# Altium schematic sheet EPS_CTRL_AB_Supply.SchDoc: CTRL-A and CTRL-B / Supply
size A4; SheetNumber: 16; SheetTotal: 51
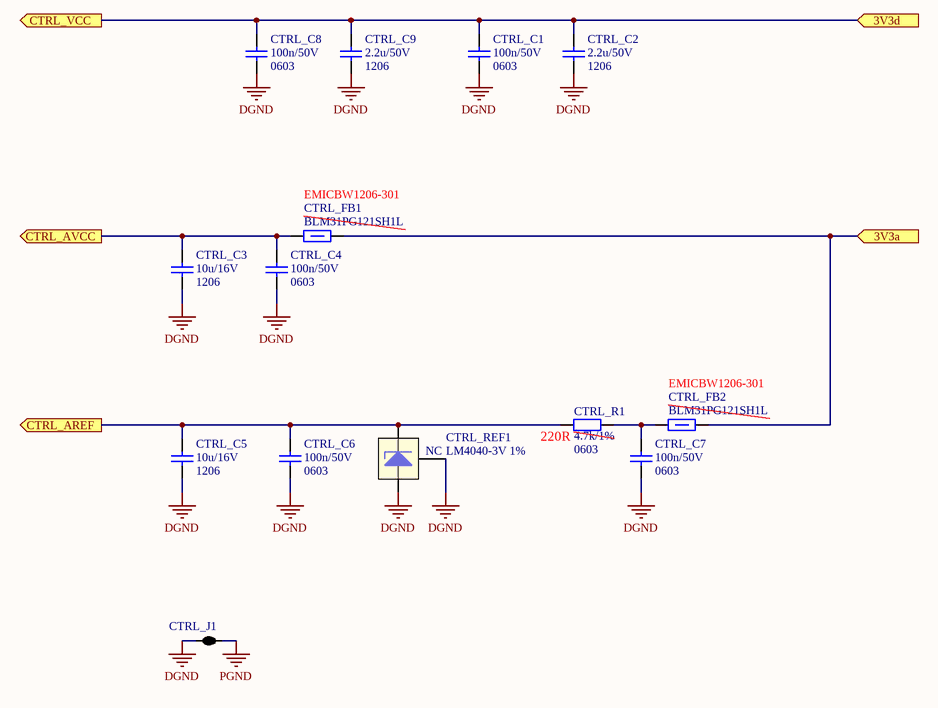
[diagram p0: EPS_CTRL_AB_Supply.SchDoc]

## Parts
CTRL_C1  Package: 0603  [SMD_Capacitor_0603]  (hidden comment: 100n/50V)
CTRL_C2  Package: 1206  [SMD_Capacitor_1206]  (hidden comment: 2.2u/50V)
CTRL_C3  Packge: 1206  [SMD_Capacitor_1206]  (hidden comment: 10u/16V)
CTRL_C4  Package: 0603  [SMD_Capacitor_0603]  (hidden comment: 100n/50V)
CTRL_C5  Packge: 1206  [SMD_Capacitor_1206]  (hidden comment: 10u/16V)
CTRL_C6  Package: 0603  [SMD_Capacitor_0603]  (hidden comment: 100n/50V)
CTRL_C7  Package: 0603  [SMD_Capacitor_0603]  (hidden comment: 100n/50V)
CTRL_C8  Package: 0603  [SMD_Capacitor_0603]  (hidden comment: 100n/50V)
CTRL_C9  Package: 1206  [SMD_Capacitor_1206]  (hidden comment: 2.2u/50V)
CTRL_FB1  120R/100MHz  [SMD_FerriteBead_1206]  (value not drawn)
CTRL_FB2  120R/100MHz  [SMD_FerriteBead_1206]  (value not drawn)
CTRL_J1  2 way net tie junction  [2way_LP]  (value not drawn)  (net tie, no BOM)
CTRL_R1  Package: 0603  [SMD_Resistor_0603]  (hidden comment: 4.7k/1%)
CTRL_REF1  LM4040-3V 1%  [SOT23-3]

## Ports
3V3a (in), 3V3d (in), CTRL_AREF (out), CTRL_AVCC (out), CTRL_VCC (out)

## Nets
DGND: CTRL_C1.2 CTRL_C2.2 CTRL_C3.2 CTRL_C4.2 CTRL_C5.2 CTRL_C6.2 CTRL_C7.2 CTRL_C8.2 CTRL_C9.2 CTRL_J1.2 CTRL_REF1.2(A) CTRL_REF1.3(NC)
PGND: CTRL_J1.1
3V3a: CTRL_FB1.1 CTRL_FB2.1 ; port 3V3a
3V3d: CTRL_C1.1 CTRL_C2.1 CTRL_C8.1 CTRL_C9.1 ; port CTRL_VCC, port 3V3d
CTRL_AREF: CTRL_C5.1 CTRL_C6.1 CTRL_R1.1 CTRL_REF1.1(K) ; port CTRL_AREF
CTRL_AVCC: CTRL_C3.1 CTRL_C4.1 CTRL_FB1.2 ; port CTRL_AVCC
NetCTRL_C7_1: CTRL_C7.1 CTRL_FB2.2 CTRL_R1.2

## Notes on the sheet
- (near CTRL_FB1) EMICBW1206-301
- (near CTRL_FB2) EMICBW1206-301
- (near CTRL_R1) 220R
- Title:
- Project:
- Author:
- Model:
- Document Number:
- Checked by:
- Rev:
- Date:
- Approved by:
- Sheet:
- of
- File name:

## Library data of the parts
CTRL_C1 CTRL_C4 CTRL_C6-CTRL_C8 = Cer_C0603T104K5RALTU: Ceramic Cap Kemet COTS 100n/50V X7R 0603; Manufacturer: Kemet; ManufacturerPartNumber: C0603T104K5RALTU; Value: 100n/50V
CTRL_C2 CTRL_C9 = Cer_GCJ31CR71H225KA12L: Ceramic Cap Murata Automotive 2.2u/50V X7R 1206; Manufacturer: Murata; ManufacturerPartNumber: GCJ31CR71H225KA12L; Value: 2.2u/50V
CTRL_C3 CTRL_C5 = Cer_C1206T106K4RACTU: Ceramic Cap Kemet COTS 10u/16V X7R 1206; ManufacturerPartNumber: C1206T106K4RACTU; Manufacturer: Kemet; Value: 10u/16V
CTRL_FB1 CTRL_FB2 = BLM31PG121SH1L: Ferrite bead, 1206, 0.02HM, 3.5A.; Manufacturer: Murata; Current Rating: 3.5A; Series Resistance DC: 0.02R; Package: 1206; Value: 120R/100MHz; ManufacturerPartNumber: BLM31PG121SH1L
CTRL_J1 = 2way: ComponentLink1URL: http://www.edatools.cz/addons; ComponentLink1Description: Source; FootprintNote: LP=12mil, MP=40mil, HP=120mil
CTRL_R1 = Res: Value: 4.7k/1%
CTRL_REF1 = LM4040DIM3-3.0: Shunt V-REF, 3V, 1%, SOT23-3; Manufacturer: Texas Instruments; ManufacturerPartNumber: LM4040DIM3-3.0; HelpUrl: http://www.ti.com/lit/ds/symlink/lm4040-n.pdf; Value: LM4040-3V 1%